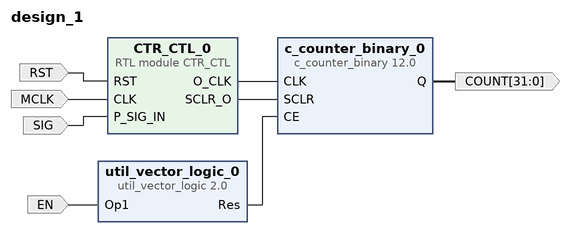
[diagram p0: block diagram of the top level]
# Vivado block design design_1, xc7z020clg400-1, Vivado 2019.1
create_bd_design design_1

create_bd_port -dir I RST
create_bd_port -dir I MCLK
create_bd_port -dir I SIG
create_bd_port -dir I EN
create_bd_port -dir O -from 31 -to 0 COUNT

create_bd_cell -type ip -vlnv xilinx.com:ip:c_counter_binary:12.0 c_counter_binary_0
set_property -dict {CONFIG.CE true CONFIG.Output_Width 32 CONFIG.SCLR true} [get_bd_cells c_counter_binary_0]
create_bd_cell -type module -reference CTR_CTL CTR_CTL_0
create_bd_cell -type ip -vlnv xilinx.com:ip:util_vector_logic:2.0 util_vector_logic_0
set_property -dict {CONFIG.C_OPERATION not CONFIG.C_SIZE 1} [get_bd_cells util_vector_logic_0]

# ---- connections ----

connect_bd_net [get_bd_pins CTR_CTL_0/O_CLK] [get_bd_pins c_counter_binary_0/CLK]
connect_bd_net [get_bd_pins CTR_CTL_0/SCLR_O] [get_bd_pins c_counter_binary_0/SCLR]
connect_bd_net [get_bd_ports RST] [get_bd_pins CTR_CTL_0/RST]
connect_bd_net [get_bd_ports MCLK] [get_bd_pins CTR_CTL_0/CLK]
connect_bd_net [get_bd_ports SIG] [get_bd_pins CTR_CTL_0/P_SIG_IN]
connect_bd_net [get_bd_pins c_counter_binary_0/Q] [get_bd_ports COUNT]
connect_bd_net [get_bd_pins util_vector_logic_0/Res] [get_bd_pins c_counter_binary_0/CE]
connect_bd_net [get_bd_ports EN] [get_bd_pins util_vector_logic_0/Op1]

validate_bd_design
save_bd_design
